# EAGLE schematic heart (EAGLE 4.15)
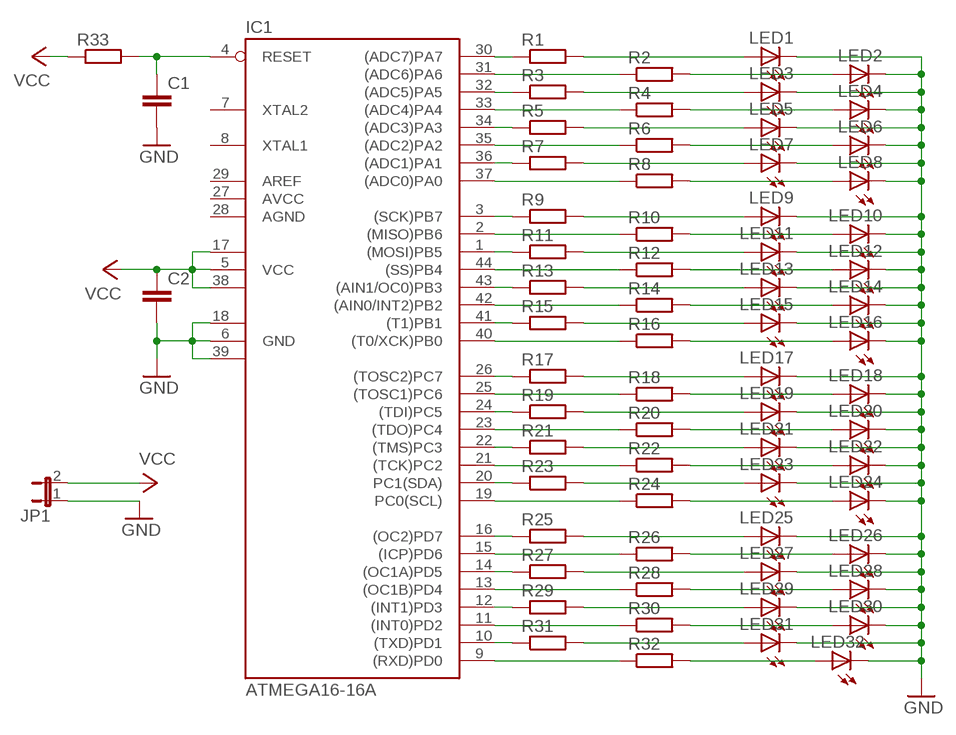
[diagram p0: schematic, sheet 1]

## Parts
C1  C-EUC0805K  [C0805K]
C2  C-EUC0805K  [C0805K]
IC1  ATMEGA16-16A  [TQFP44]
JP1  JP1E  [JP1]
LED1  LEDSMT1206  [1206]
LED2  LEDSMT1206  [1206]
LED3  LEDSMT1206  [1206]
LED4  LEDSMT1206  [1206]
LED5  LEDSMT1206  [1206]
LED6  LEDSMT1206  [1206]
LED7  LEDSMT1206  [1206]
LED8  LEDSMT1206  [1206]
LED9  LEDSMT1206  [1206]
LED10  LEDSMT1206  [1206]
LED11  LEDSMT1206  [1206]
LED12  LEDSMT1206  [1206]
LED13  LEDSMT1206  [1206]
LED14  LEDSMT1206  [1206]
LED15  LEDSMT1206  [1206]
LED16  LEDSMT1206  [1206]
LED17  LEDSMT1206  [1206]
LED18  LEDSMT1206  [1206]
LED19  LEDSMT1206  [1206]
LED20  LEDSMT1206  [1206]
LED21  LEDSMT1206  [1206]
LED22  LEDSMT1206  [1206]
LED23  LEDSMT1206  [1206]
LED24  LEDSMT1206  [1206]
LED25  LEDSMT1206  [1206]
LED26  LEDSMT1206  [1206]
LED27  LEDSMT1206  [1206]
LED28  LEDSMT1206  [1206]
LED29  LEDSMT1206  [1206]
LED30  LEDSMT1206  [1206]
LED31  LEDSMT1206  [1206]
LED32  LEDSMT1206  [1206]
R1  R-EU_M0805  [M0805]
R2  R-EU_M0805  [M0805]
R3  R-EU_M0805  [M0805]
R4  R-EU_M0805  [M0805]
R5  R-EU_M0805  [M0805]
R6  R-EU_M0805  [M0805]
R7  R-EU_M0805  [M0805]
R8  R-EU_M0805  [M0805]
R9  R-EU_M0805  [M0805]
R10  R-EU_M0805  [M0805]
R11  R-EU_M0805  [M0805]
R12  R-EU_M0805  [M0805]
R13  R-EU_M0805  [M0805]
R14  R-EU_M0805  [M0805]
R15  R-EU_M0805  [M0805]
R16  R-EU_M0805  [M0805]
R17  R-EU_M0805  [M0805]
R18  R-EU_M0805  [M0805]
R19  R-EU_M0805  [M0805]
R20  R-EU_M0805  [M0805]
R21  R-EU_M0805  [M0805]
R22  R-EU_M0805  [M0805]
R23  R-EU_M0805  [M0805]
R24  R-EU_M0805  [M0805]
R25  R-EU_M0805  [M0805]
R26  R-EU_M0805  [M0805]
R27  R-EU_M0805  [M0805]
R28  R-EU_M0805  [M0805]
R29  R-EU_M0805  [M0805]
R30  R-EU_M0805  [M0805]
R31  R-EU_M0805  [M0805]
R32  R-EU_M0805  [M0805]
R33  R-EU_M0805  [M0805]

## Nets
GND: C1.2 C2.2 IC1.6(GND) IC1.18(GND1) IC1.39(GND2) JP1.1 LED1.C LED2.C LED3.C LED4.C LED5.C LED6.C LED7.C LED8.C LED9.C LED10.C LED11.C LED12.C LED13.C LED14.C LED15.C LED16.C LED17.C LED18.C LED19.C LED20.C LED21.C LED22.C LED23.C LED24.C LED25.C LED26.C LED27.C LED28.C LED29.C LED30.C LED31.C LED32.C
N$1: C1.1 IC1.4(RESET) R33.2
N$2: IC1.30((ADC7)PA7) R1.1
N$3: IC1.32((ADC5)PA5) R3.1
N$4: IC1.34((ADC3)PA3) R5.1
N$5: IC1.36((ADC1)PA1) R7.1
N$6: IC1.3((SCK)PB7) R9.1
N$7: IC1.1((MOSI)PB5) R11.1
N$8: IC1.43((AIN1/OC0)PB3) R13.1
N$9: IC1.41((T1)PB1) R15.1
N$10: IC1.26((TOSC2)PC7) R17.1
N$11: IC1.24((TDI)PC5) R19.1
N$12: IC1.22((TMS)PC3) R21.1
N$13: IC1.20(PC1(SDA)) R23.1
N$14: IC1.16((OC2)PD7) R25.1
N$15: IC1.14((OC1A)PD5) R27.1
N$16: IC1.12((INT1)PD3) R29.1
N$17: IC1.10((TXD)PD1) R31.1
N$18: IC1.31((ADC6)PA6) R2.1
N$19: IC1.33((ADC4)PA4) R4.1
N$20: IC1.35((ADC2)PA2) R6.1
N$21: IC1.37((ADC0)PA0) R8.1
N$22: IC1.2((MISO)PB6) R10.1
N$23: IC1.44((SS)PB4) R12.1
N$24: IC1.42((AIN0/INT2)PB2) R14.1
N$25: IC1.40((T0/XCK)PB0) R16.1
N$26: IC1.25((TOSC1)PC6) R18.1
N$27: IC1.23((TDO)PC4) R20.1
N$28: IC1.21((TCK)PC2) R22.1
N$29: IC1.19(PC0(SCL)) R24.1
N$30: IC1.15((ICP)PD6) R26.1
N$31: IC1.13((OC1B)PD4) R28.1
N$32: IC1.11((INT0)PD2) R30.1
N$33: IC1.9((RXD)PD0) R32.1
N$34: LED1.A R1.2
N$35: LED2.A R2.2
N$36: LED3.A R3.2
N$37: LED4.A R4.2
N$38: LED5.A R5.2
N$39: LED6.A R6.2
N$40: LED7.A R7.2
N$41: LED8.A R8.2
N$42: LED9.A R9.2
N$43: LED10.A R10.2
N$44: LED11.A R11.2
N$45: LED12.A R12.2
N$46: LED13.A R13.2
N$47: LED15.A R15.2
N$48: LED16.A R16.2
N$62: LED14.A R14.2
N$66: LED17.A R17.2
N$68: LED18.A R18.2
N$70: LED19.A R19.2
N$72: LED20.A R20.2
N$74: LED21.A R21.2
N$76: LED22.A R22.2
N$78: LED23.A R23.2
N$80: LED24.A R24.2
N$82: LED25.A R25.2
N$84: LED26.A R26.2
N$86: LED27.A R27.2
N$88: LED28.A R28.2
N$90: LED29.A R29.2
N$92: LED30.A R30.2
N$94: LED31.A R31.2
N$96: LED32.A R32.2
VCC: C2.1 IC1.5(VCC) IC1.17(VCC1) IC1.38(VCC2) JP1.2 R33.1
Unconnected: IC1.7(XTAL2) IC1.8(XTAL1)

## Power pins joined to a net without a drawn wire
AGND: IC1.28(AGND)
AREF: IC1.29(AREF)
AVCC: IC1.27(AVCC)

## Library data of the parts
C1 C2 = rcl:C-EU: CAPACITOR, European symbol
IC1 = avr:ATMEGA16: MICROCONTROLLER 16 Kbytes FLASH 1 kbytes SRAM 512 bytes EEPROM USART 8-channel 10 bit ADC
JP1 = jumper:JP1E: JUMPER
LED1-LED32 = led:LED: LED OSRAM: - CHIPLED LG R971, LG N971, LY N971, LG Q971, LY Q971, LO R971, LY R971 LH N974, LH R974 LS Q976, LO Q976, LY Q976 LO Q996 - Hyper CHIPLED LW Q18S LB Q993, LB Q99A, LB R99A - SideLED LS A670, LO A670, LY A670, LG A670, LP A670 LB A673, LV A673, LT A673, LW A673 LH A674 LY A675 LS A676, LA A676, LO A676, LY A676, LW A676 LS A679, LY A679, LG A679 - Hyper Micro SIDELED® LS Y876, LA Y876, LO Y876, LY Y876 LT Y87S - SmartLED LW L88C, LW L88S LB L89C, LB L89S, LG L890 LS L89K, LO L89K, LY L89K LS L896, LA L896, LO L896, LY L896 - TOPLED LS T670, LO T670, LY T670, LG T670, LP T670 LSG T670, LSP T670, LSY T670, LOP T670, LYG T670 LG T671, LOG T671, LSG T671 LB T673, LV T673, LT T673, LW T673 LH T674 LS T676, LA T676, LO T676, LY T676, LB T676, LH T676, LSB T676, LW T676 LB T67C, LV T67C, LT T67C, LS T67K, LO T67K, LY T67K, LW E67C LS E67B, LA E67B, LO E67B, LY E67B, LB E67C, LV E67C, LT E67C LW T67C LS T679, LY T679, LG T679 LS T770, LO T770, LY T770, LG T770, LP T770 LB T773, LV T773, LT T773, LW T773 LH T774 LS E675, LA E675, LY E675, LS T675 LS T776, LA T776, LO T776, LY T776, LB T776 LHGB T686 LT T68C, LB T68C - Hyper Mini TOPLED® LB M676 - Mini TOPLED Santana® LG M470 LS M47K, LO M47K, LY M47K Source: http://www.osram.convergy.de/
R1-R33 = rcl:R-EU_: RESISTOR, European symbol